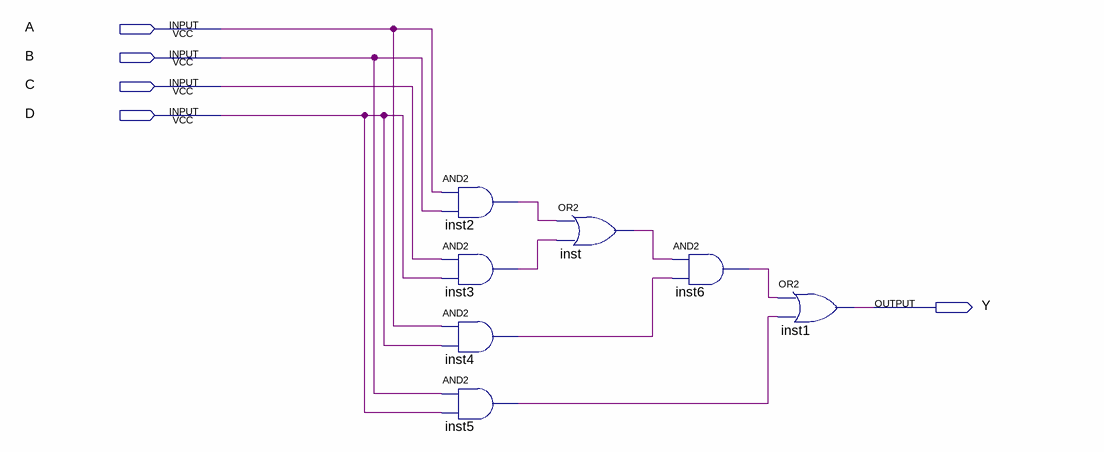
[diagram p0: schematic sheet]
// Quartus schematic Isaev11.bdf as structural Verilog: 7 symbols, 5 pins
module Isaev11 (
  input  A,
  input  B,
  input  C,
  input  D,
  output Y
);

  wire inst2_out, inst3_out, inst4_out, inst5_out, inst6_out, inst_out;

  and inst2 (inst2_out, A, B);
  and inst3 (inst3_out, C, D);
  and inst4 (inst4_out, A, D);
  and inst5 (inst5_out, B, D);
  or inst (inst_out, inst2_out, inst3_out);
  and inst6 (inst6_out, inst_out, inst4_out);
  or inst1 (Y, inst6_out, inst5_out);
endmodule
